# EasyEDA Pro project rpi-adapter-board.eprj

# Schematic Schematic1
Create Date: 2024-01-25; Page Name: P1; Project Name: rpi-adapter-board; Schematic Name: Schematic1; Update Date: 2024-01-27; Company: 嘉立创EDA; Page Size: A4; Version: V1.0
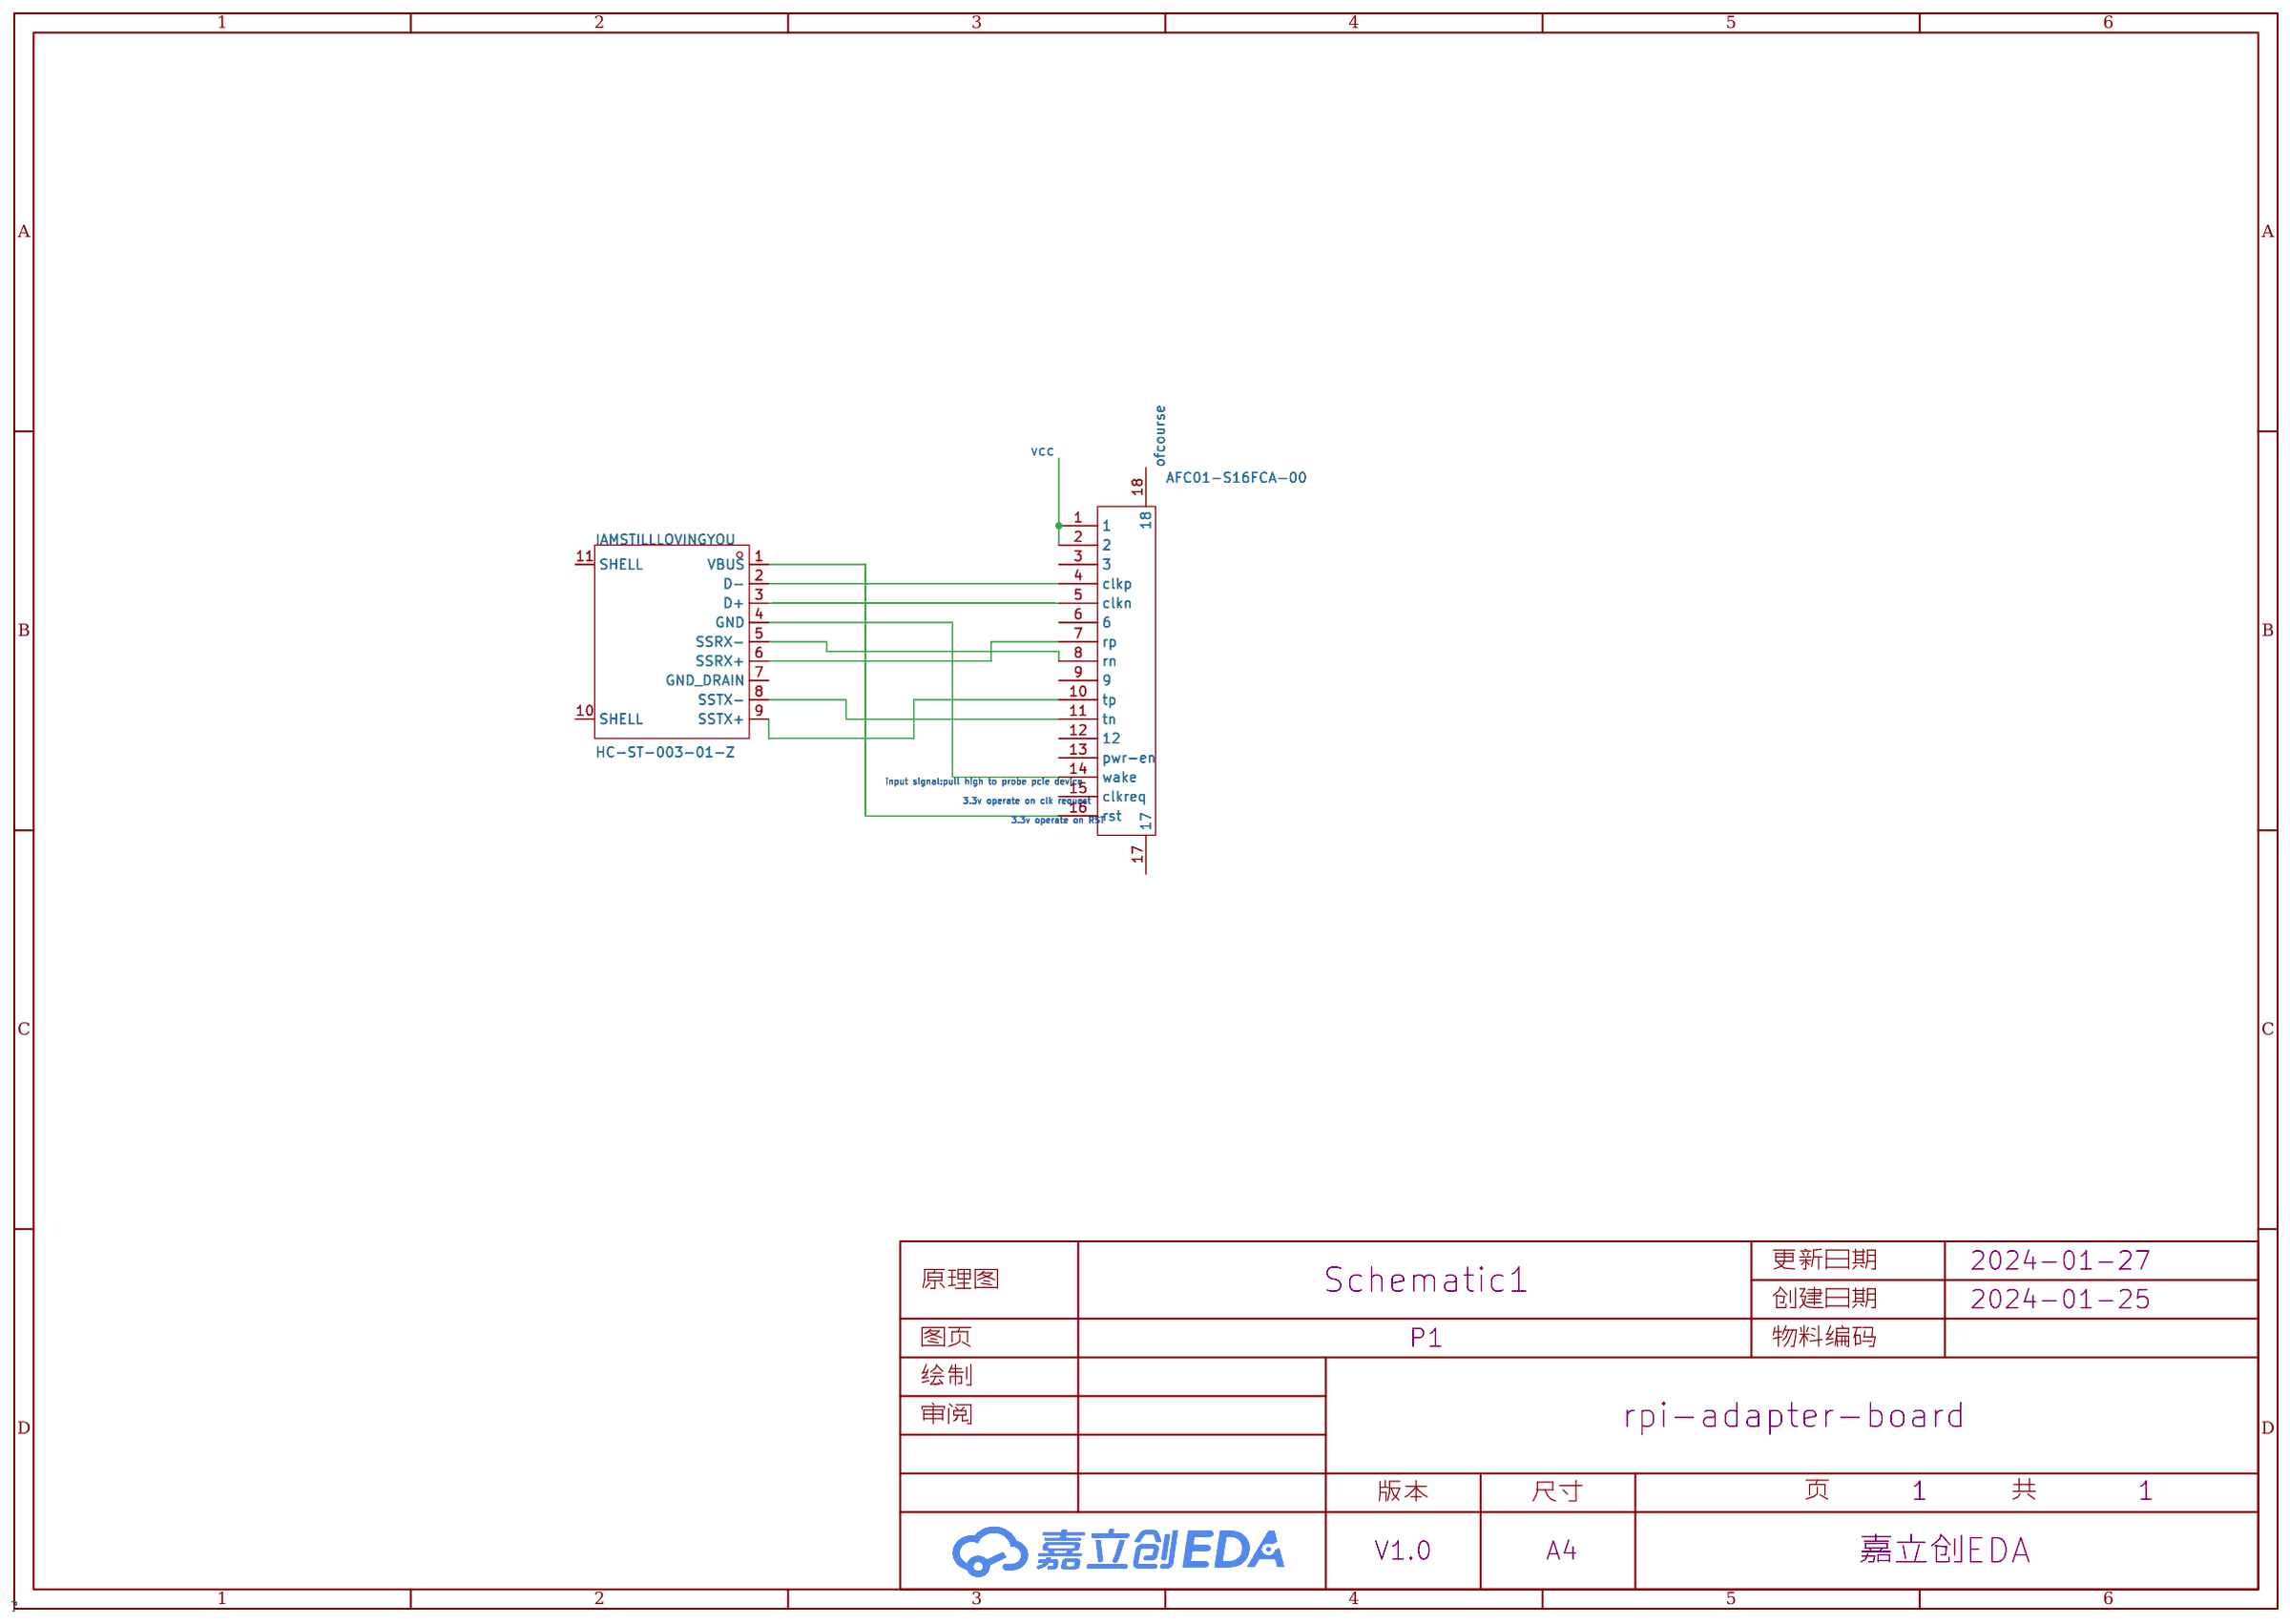
[diagram p0: schematic sheet]

## Parts
IAMSTILLLOVINGYOU  HC-ST-003-01-Z  [USB-3.0-A-TH_HC-ST-003-01-Z]
ofcourse  AFC01-S16FCA-00  [FPC-SMD_P0.50-16P_FGS-XJ-H2.0]

## Library data of the parts
IAMSTILLLOVINGYOU = HC-ST-003-01-Z: 连接器类型:Type-A;标准:USB 3.0;公母:母;端口数量:1;触点数量:9P;安装方式:弯插;额定电流 - 电源:1.5A;触头材质:铜;触头镀层:锡;工作温度范围:-40℃~+85℃;焊接温度(最大值):260℃;; LCSC Part Name: Type-A 母 弯插; Supplier Part: C2845331; Manufacturer: HCTL(华灿天禄); Supplier Footprint: 插件; JLCPCB Part Class: 扩展库; Datasheet: https://atta.szlcsc.com/upload/public/pdf/source/20221116/282C6C6D0938F009B1A8C97786A84DDB.pdf; Supplier: LCSC; Connector Type: Type-A; Standard: USB 3.0; Gender: 母; Number of Ports: 1; Number of Contacts: 9P; Mounting Style: 弯插; Current Rating - Power (Max): 1.5A; Contact Material: 铜; Contact Plating: 锡; Operating Temperature Range: -40℃~+85℃; Welding Temperature (Max): 260℃
ofcourse = AFC01-S16FCA-00: 锁定特性:翻盖式;触点类型:下接;触点数量:16P;间距:0.5mm;安装类型:卧贴;; LCSC Part Name: 间距:0.5mm P数:16P 翻盖式 下接; Supplier Part: C262665; Manufacturer: JS(钜硕电子); Supplier Footprint: SMD,P=0.5mm,卧贴; JLCPCB Part Class: 扩展库; Datasheet: https://atta.szlcsc.com/upload/public/pdf/source/20190816/C413942_2A72D1AC756EAE17EEDF756A339D4500.pdf; Supplier: LCSC; Locking Feature: 翻盖式; Contact Type: 下接; Number of Contacts: 16P; Pitch: 0.5mm; Mounting Type: 卧贴; FFC, FCB Thickness: 0.3mm; Height Above Board: 2mm

## Nets
Net-(IAMSTILLLOVINGYOU-1): IAMSTILLLOVINGYOU.1(VBUS) ofcourse.16(rst)
Net-(IAMSTILLLOVINGYOU-2): IAMSTILLLOVINGYOU.2(D-) ofcourse.4(clkp)
Net-(IAMSTILLLOVINGYOU-3): IAMSTILLLOVINGYOU.3(D+) ofcourse.5(clkn)
Net-(IAMSTILLLOVINGYOU-4): IAMSTILLLOVINGYOU.4(GND) ofcourse.14(wake)
Net-(IAMSTILLLOVINGYOU-5): IAMSTILLLOVINGYOU.5(SSRX-) ofcourse.8(rn)
Net-(IAMSTILLLOVINGYOU-6): IAMSTILLLOVINGYOU.6(SSRX+) ofcourse.7(rp)
Net-(IAMSTILLLOVINGYOU-8): IAMSTILLLOVINGYOU.8(SSTX-) ofcourse.11(tn)
Net-(IAMSTILLLOVINGYOU-9): IAMSTILLLOVINGYOU.9(SSTX+) ofcourse.10(tp)
Net-(ofcourse-1): ofcourse.1 ofcourse.2

Not connected (* = marked no-connect by the designer): IAMSTILLLOVINGYOU 7(GND_DRAIN) 10(SHELL) 11(SHELL); ofcourse 3 6 9 12 13(pwr-en) 15(clkreq) 17 18

## Notes on the sheet
- vcc
- input signal:pull high to probe pcie device
- 3.3v operate on clk request
- 3.3v operate on RST

# Board PCB1
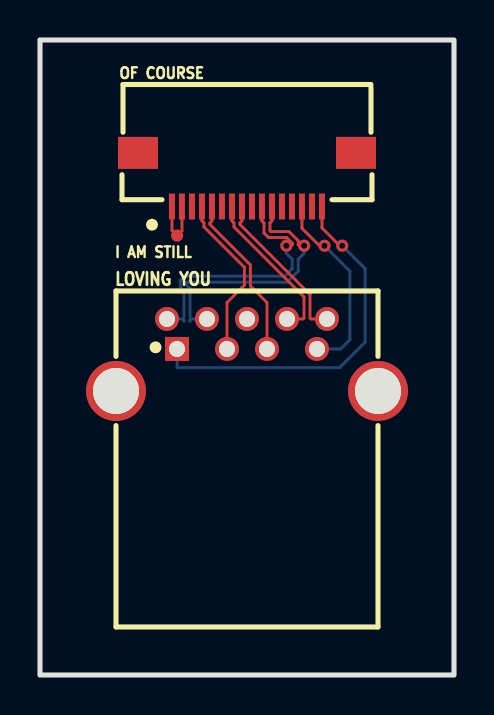
[diagram p1: board, top side]
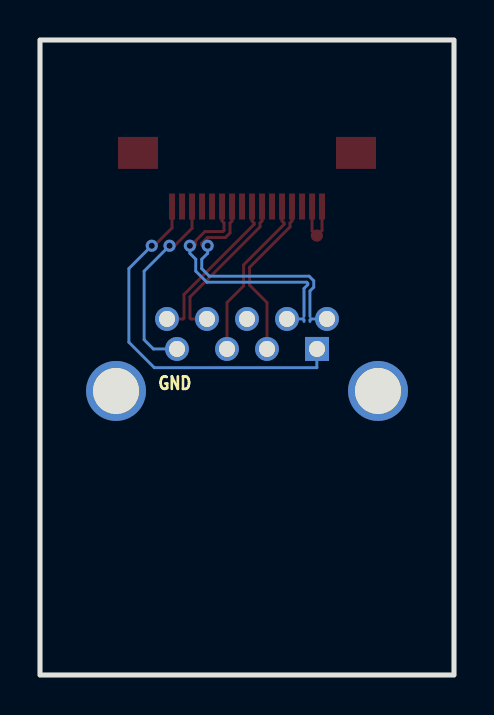
[diagram p2: board, bottom side, seen from below]

Outline 20.7 x 31.75 mm; copper layers: Top Layer, Bottom Layer. Coordinates in mm from the lower left corner of the outline.
Outline path: rectangle 0,31.75 20.7,0
Stack: Top Layer 0.035mm / Dielectric1 1.51mm FR4 er 4.5 / Bottom Layer 0.035mm

## Design rules (mm)
net $1N942: DP2
net $1N958: DP2
net $1N1181: DP1
net $1N1190: DP1
net $1N1145: DP3
net $1N1137: DP3
template: JLCPCB Capability(Two Layers Board)
spacing copperThickness1oz (default): track to track 0.102, other pairs 0.152 to 0.3
spacing copperThickness2oz: track to track 0.203, other pairs 0.152 to 0.3
track width copperThickness1oz (default): min 0.127, default 0.254, max 2.54
track width copperThickness2oz: min 0.203, default 0.254, max 2.54
differential pair differentialPair (default): width min 0.127, default 0.254, max 2.54; gap min 0.152, default 0.152
via viaSize (default): diameter min 0.5, default 0.61, max 10; hole min 0.3, default 0.305, max 6.3

## Placement (name value [footprint] x y rotation side)
I AM STILL  HC-ST-003-01-Z  [USB-3.0-A-TH_HC-ST-003-01-Z]  10.35 16 0 top
NOREF  -  [Pad_e54]  6.86 21.97 0 top
OF COURSE  AFC01-S16FCA-00  [FPC-SMD_P0.50-16P_FGS-XJ-H2.0]  10.35 24.77 0 top

## Footprints (pads in the part's own frame, mm; a bottom-side part is the same pattern mirrored in y, then rotated)
FPC-SMD_P0.50-16P_FGS-XJ-H2.0
  rect 0.3x1.3 smd: 1(-3.752,-1.34) 2(-3.254,-1.339) 3(-2.752,-1.34) 4(-2.252,-1.34) 5(-1.752,-1.34) 6(-1.252,-1.34) 7(-0.752,-1.34) 8(-0.252,-1.34) 9(0.248,-1.34) 10(0.748,-1.34) 11(1.248,-1.34) 12(1.748,-1.34) 13(2.248,-1.34) 14(2.748,-1.34) 15(3.248,-1.34) 16(3.748,-1.34)
  rect 2x1.6 smd: 17(-5.45,1.34) 18(5.45,1.34)
Pad_e54
  round 0.61 smd: TP4(0,0)
USB-3.0-A-TH_HC-ST-003-01-Z
  rect 1.2x1.2 hole 0.8: 1(-3.5,0.3)
  round 1.2 hole 0.8: 2(-1,0.3) 3(1,0.3) 4(3.5,0.3) 5(4,1.8) 6(2,1.8) 7(0,1.8) 8(-2,1.8) 9(-4,1.8)
  round 3 hole 2.3: 10(-6.55,-1.8) 11(6.55,-1.8)

## Nets
$1N462: NOREF.TP4 OF COURSE.1 OF COURSE.2
$1N942: I AM STILL.2 OF COURSE.4
$1N958: I AM STILL.3 OF COURSE.5
$1N1137: I AM STILL.8 OF COURSE.11
$1N1145: I AM STILL.9 OF COURSE.10
$1N1181: I AM STILL.6 OF COURSE.7
$1N1190: I AM STILL.5 OF COURSE.8
$1N1284: I AM STILL.1 OF COURSE.16
$1N1289: I AM STILL.4 OF COURSE.14
$1N1617: OF COURSE.13

Pads without a net: I AM STILL 7 10 11; OF COURSE 3 6 9 12 15 17 18

## Via types
v1: diameter 0.61, hole 0.305, Top Layer to Bottom Layer, 4 vias

## Routing (per net, layer and track width the routed paths; a pad name or vN(x,y) marks a point on that pad's centre or on a via; arc(x,y) is an arc through that point)
$1N462: length 3.1
  Top Layer w0.147: OF COURSE.2 7.1,22.21 NOREF.TP4 6.6,22.23 OF COURSE.1
$1N942: length 8.3
  Top Layer w0.147: 9.35,16.32 9.35,18.62 10.22,19.49 10.22,20.38 8.2,22.4 8.2,22.6 8.1,22.7 OF COURSE.4
$1N958: length 8.3
  Top Layer w0.147: OF COURSE.5 8.6,22.7 8.5,22.6 8.5,22.53 10.52,20.51 10.52,19.45 11.35,18.62 I AM STILL.3
$1N1137: length 13.3
  Top Layer w0.147: OF COURSE.11 11.6,22.7 11.5,22.6 11.5,22.23 11.55,22.17 12.45,22.17 12.91,21.71 12.91,21.52 12.97,21.46 v1(13.21,21.46)
  Bottom Layer w0.147: 7.5,17.68 7.5,17.75 7.55,17.8 I AM STILL.8 ; v1(13.21,21.46) 13.21,21.08 12.91,20.79 12.91,20.2 12.36,19.64 7.37,19.64 7.31,19.59 7.31,19.51 7.5,19.33 7.5,17.93
$1N1145: length 13.3
  Top Layer w0.147: OF COURSE.10 11.1,22.7 11.2,22.6 11.2,22.1 11.43,21.87 12.33,21.87 12.61,21.59 12.61,21.52 12.56,21.46 v1(12.32,21.46)
  Bottom Layer w0.147: I AM STILL.9 7.15,17.8 7.2,17.75 7.2,17.68 ; 7.2,17.93 7.2,19.2 7.01,19.39 7.01,19.71 7.24,19.94 12.23,19.94 12.61,20.32 12.61,20.79 12.32,21.08 v1(12.32,21.46)
$1N1181: length 7.9
  Top Layer w0.147: OF COURSE.7 9.6,22.7 9.7,22.6 9.7,22.4 13.2,18.9 13.2,17.85 13.15,17.8 I AM STILL.6
$1N1190: length 7.9
  Top Layer w0.147: I AM STILL.5 13.55,17.8 13.5,17.85 13.5,19.03 10,22.53 10,22.6 10.1,22.7 OF COURSE.8
$1N1284: length 18.6
  Top Layer w0.147: OF COURSE.16 14.1,22.35 14.99,21.46 v1(15.11,21.46)
  Bottom Layer w0.147: I AM STILL.1 6.86,16.29 6.86,15.37 14.99,15.37 16.26,16.64 16.26,20.32 v1(15.11,21.46)
$1N1289: length 9.6
  Top Layer w0.147: OF COURSE.14 13.1,22.33 13.97,21.46 v1(14.22,21.46)
  Bottom Layer w0.147: I AM STILL.4 15.03,16.3 15.49,16.76 15.49,20.19 v1(14.22,21.46)

## Text on the board
Bottom Silkscreen Layer: GND
Top Silkscreen Layer: LOVING YOU
